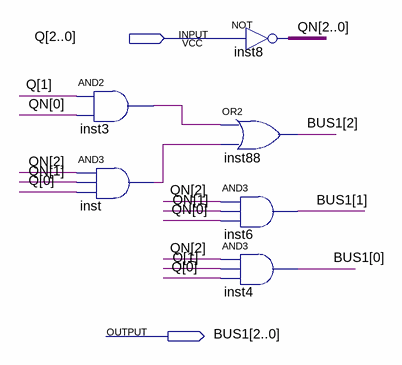
[diagram p0: schematic sheet]
// Quartus schematic BUS1.bdf as structural Verilog: 6 symbols, 2 pins
module BUS1 (
  input  [2:0] Q,
  output [2:0] BUS1
);

  wire inst3_out, inst_out;
  wire [2:0] QN;

  and inst3 (inst3_out, Q[1], QN[0]);
  and inst (inst_out, QN[2], QN[1], Q[0]);
  or inst88 (BUS1[2], inst3_out, inst_out);
  and inst6 (BUS1[1], QN[2], QN[1], QN[0]);
  and inst4 (BUS1[0], QN[2], Q[1], Q[0]);
  assign QN = ~Q;  // NOT inst8, 3 bits wide
endmodule
